# Altium schematic sheet Circuit.SchDoc
size A3; ApprovedBy: Dr.Ogr.Uys.Sertaç Savaş; CheckedBy: Dr.Ogr.Uys.Sertaç Savaş; Engineer: Nasıf Can Peltek; DocumentNumber: 2; Revision: -; SheetNumber: 2; SheetTotal: 2; releaseDate: 24.03.2024; changeDate: -; Department: Faculty Of  Engineering; Size: A3; projeDescription: N555 Driver Card; fileName: Circuit.SchDoc
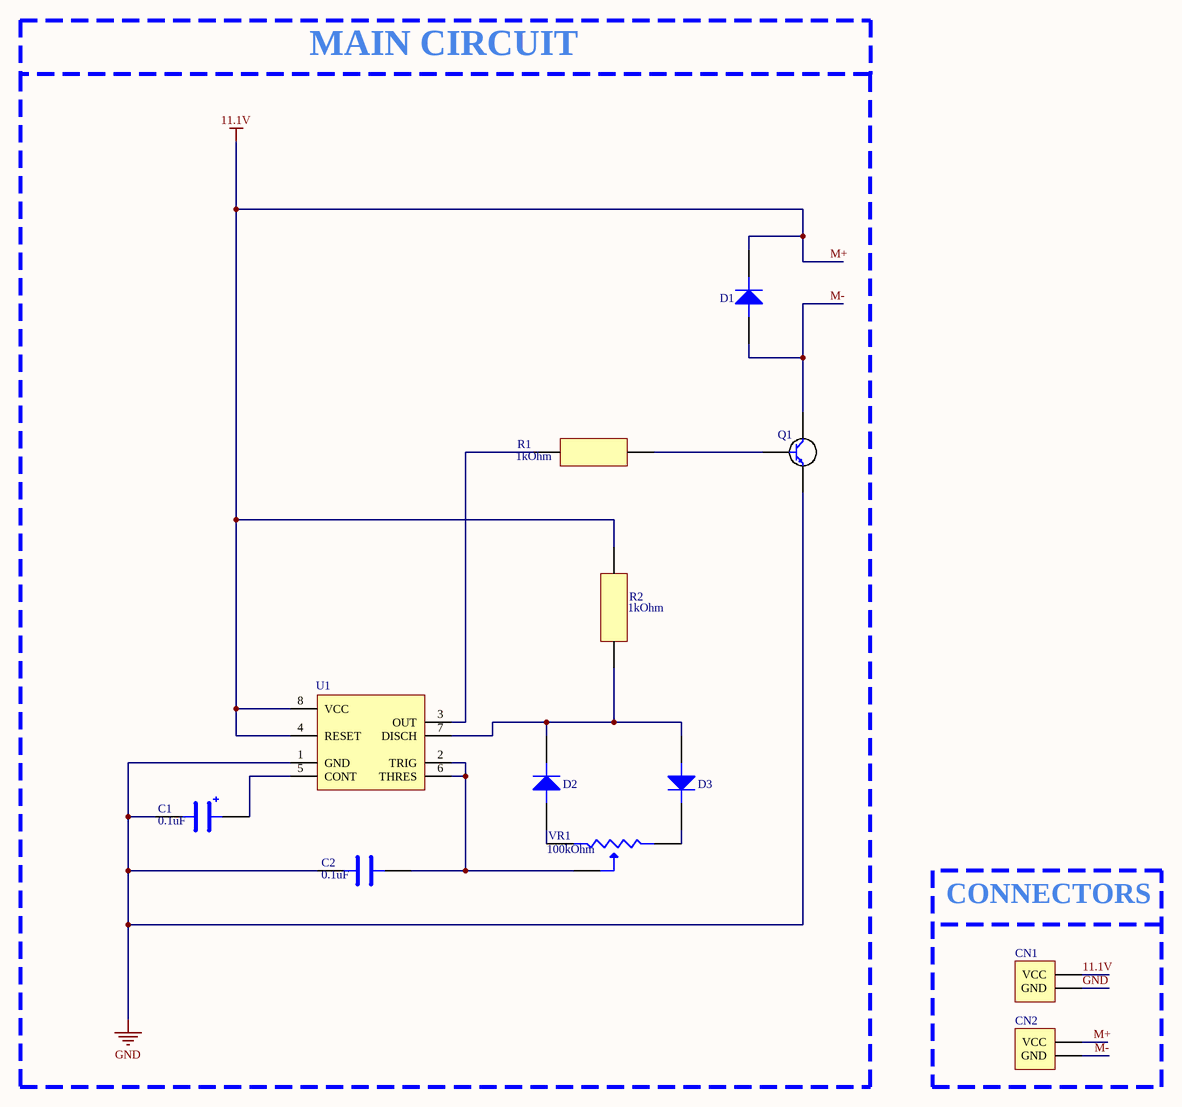
[diagram p0: Circuit.SchDoc]

## Parts
C1  Capacitor: 0.1uF  [CAP_ALUM]  (hidden comment: 860020772001)
C2  Capacitor: 0.1uF  [CAP_FILM]  (hidden comment: R82EC3100DQ70J)
CN1  732-10955-ND  [BULK]  (value not drawn)
CN2  732-10955-ND  [BULK]  (value not drawn)
D1  1N4007G-T  [DO41]  (value not drawn)
D2  1N4007G-T  [DO41]  (value not drawn)
D3  1N4007G-T  [DO41]  (value not drawn)
Q1  497-2543-5-ND  [TO220]  (value not drawn)
R1  Resistor: 1kOhm  [AXIAL]  (hidden comment: CF14JT1K00)
R2  Resistor: 1kOhm  [AXIAL]  (hidden comment: CF14JT1K00)
U1  NE555P  [DIP8]  (value not drawn)
VR1  Resistor: 100kOhm  [POT]  (hidden comment: P160KN2-0EC15B100K)

## Blocks framed on the sheet
MAIN CIRCUIT: C1 C2 D1-D3 Q1 R1 R2 U1 VR1
CONNECTORS: CN1 CN2

## Nets
11.1V: CN1.1(VCC) CN2.1(VCC) D1.2 R2.2 U1.4(RESET) U1.8(VCC)  [also labelled M+]
GND: C1.1(Cathode) C2.1 CN1.2(GND) Q1.3(Emitter) U1.1(GND)
M-: CN2.2(GND) D1.1 Q1.2(Collector)
NetC1_2: C1.2(Anode) U1.5(CONT)
NetC2_2: C2.2 U1.2(TRIG) U1.6(THRES) VR1.2
NetD2_1: D2.1 VR1.1
NetD2_2: D2.2 D3.1 R2.1 U1.7(DISCH)
NetD3_2: D3.2 VR1.3
NetQ1_1: Q1.1(Base) R1.2
NetR1_1: R1.1 U1.3(OUT)

## Notes on the sheet
- FILE NAME
- PREPARED BY
- DESCRIPTION
- RELEASE DATE
- DEPARTMENT
- CHECKED BY
- APPROVED BY
- SIZE
- REVISION
- CHANGE DATE
- SHEET
- /

## Library data of the parts
C1 = CAP ALUM 0.1uF: WCAP-ATG5 Aluminum Electrolytic Capacitors; Manufacturer: Wurth Electronics; Designed By: Nasıf Can Peltek; Leakage Current: 3uA; Pitch: 2mm; Max Operating Voltage: 63V; Supplier 1: Mouser; Manufacturer Part Number: 860020772001; RoHS: Yes; Category: Aluminum Electrolytic Capacitors; Stock 1: 776; Pricing 1: 1=0,11, 10=0,109, 50=0,093, 100=0,081, 1000=0,06, 10000=0,06 (USD); Length: 11mm; ComponentLink1URL: http://www.farnell.com/datasheets/1879675.pdf?src-supplier=Farnell; ComponentLink1Description: http://www.farnell.com/datasheets/1879675.pdf?src-supplier=Farnell; ComponentLink2URL: http://katalog.we-online.de/pbs/datasheet/860020772001.pdf?src-supplier=Digikey; ComponentLink2Description: http://katalog.we-online.de/pbs/datasheet/860020772001.pdf?src-supplier=Digikey; ComponentLink3URL: https://katalog.we-online.de/pbs/datasheet/860020772001.pdf?src-supplier=Digikey; ComponentLink3Description: https://katalog.we-online.de/pbs/datasheet/860020772001.pdf?src-supplier=Digikey; ComponentLink4URL: http://www.farnell.com/datasheets/1879675.pdf?src-supplier=Element14; ComponentLink4Description: http://www.farnell.com/datasheets/1879675.pdf?src-supplier=Element14; Supplier Part Number 1: 710-860020772001; Case/Package: RADIAL
C2 = CAP FILM 0.1uF: Cap Film 0.1uF 100V PET 5% (7.2 X 2.5 X 6.5mm) Radial 5mm 105C Ammo Pack; Manufacturer: KEMET; Designed By: Nasıf Can Peltek; Max Operating Voltage: 63V; Supplier 1: Digikey; Manufacturer Part Number: R82EC3100DQ70J; RoHS: Yes; Category: Film Capacitors; Stock 1: 75554; Pricing 1: 1=0,3, 10=0,195, 50=0,1436, 100=0,1169, 500=0,09226, 1000=0,07791 (USD); Number of Pins: 2NUMBER; ComponentLink1URL: https://datasheet.ciiva.com/11790/0900766b8002a2e5-11790687.pdf?src-supplier=Rs; ComponentLink1Description: https://datasheet.ciiva.com/11790/0900766b8002a2e5-11790687.pdf?src-supplier=Rs; ComponentLink2URL: https://datasheet.ciiva.com/8031/1425445-8031381.pdf?src-supplier=Element14; ComponentLink2Description: https://datasheet.ciiva.com/8031/1425445-8031381.pdf?src-supplier=Element14; Supplier Part Number 1: 399-5453-1-ND; Case/Package: RADIAL
CN1 CN2 = TERMINAL BLOCK: Series 1377 - 5.00 mm Horizontal Entry with Pressure Clamp WR-TBL, 2 pin; Manufacturer: Wurth Electronics; Manufacturer Part Number: 691137710002; Designed By: Nasıf Can Peltek; Plating: Copper Alloy,ZINC PLATED; Number of Levels: 1; Number of Positions Per Level: 2; Current: 16A; Voltage: 300V; Number of Contacts: 2NUMBER; Wire Gauge (Max): 30AWG; Wire Gauge (Min): 12AWG; Supplier 1: Digikey; RoHS: Yes; Category: Terminal Blocks; Stock 1: 3711; Pricing 1: 1=0,41, 10=0,363, 50=0,32, 100=0,287, 500=0,277 (USD); Mount: Through Hole; Number of Pins: 2NUMBER; Color: Green; Housing Material: PC; Contact Material: 153,154ConductorMaterial; Min Operating Temperature: -30°C; Max Operating Temperature: 120°C; Termination: Screw; Series: WR-TBL Series 1377; Current Rating: 16A; Number of Rows: 1NUMBER; Voltage Rating: 300V; Height: 11.6mm; Lead Pitch: 5mm; RoHS Compliant: Yes; ComponentLink1URL: https://katalog.we-online.de/em/datasheet/691137710002.pdf?src-supplier=Digikey; ComponentLink1Description: https://katalog.we-online.de/em/datasheet/691137710002.pdf?src-supplier=Digikey; Supplier Part Number 1: 732-10955-ND; Case/Package: BULK
D1-D3 = DIODE 1N4007: Diode Standard 1000V (1kV) 1A Through Hole DO-41; Manufacturer: Diodes; Designed By: Nasıf Can Peltek; Supplier 1: Digikey; Manufacturer Part Number: 1N4007G-T; RoHS: Yes; Category: Rectifier Diodes; Stock 1: 387119; Pricing 1: 1=0,28, 10=0,191, 100=0,0933, 500=0,07784, 1000=0,05409, 2000=0,04688 (USD); ComponentLink1URL: https://datasheet.ciiva.com/36525/1537942-36525995.pdf?src-supplier=Jameco; ComponentLink1Description: https://datasheet.ciiva.com/36525/1537942-36525995.pdf?src-supplier=Jameco; ComponentLink2URL: https://datasheet.ciiva.com/15219/getdatasheetpartid-213960-15219547.pdf?src-supplier=Verical; ComponentLink2Description: https://datasheet.ciiva.com/15219/getdatasheetpartid-213960-15219547.pdf?src-supplier=Verical; ComponentLink3URL: https://datasheet.ciiva.com/912/ds29002-912230.pdf?src-supplier=Digikey; ComponentLink3Description: https://datasheet.ciiva.com/912/ds29002-912230.pdf?src-supplier=Digikey; ComponentLink4URL: https://datasheet.ciiva.com/16395/ds29002-16395514.pdf?src-supplier=Future+Electronics; ComponentLink4Description: https://datasheet.ciiva.com/16395/ds29002-16395514.pdf?src-supplier=Future+Electronics; Supplier Part Number 1: 1N4007GDICT-ND; Max Supply Voltage: 1000V; Operating Supply Current: 1A; Case/Package: DO41
Q1 = BJT DARLINGTON: TIP122 Series NPN/PNP 100 V 5 A Complimentary Darlington Transistor - TO-220-3; Manufacturer: STMicroelectronics; Designed By: Nasıf Can Peltek; Max Current: 5A; Power: 2W; Max Collector Current: 500uA; Max Supply Voltage: 100V; Supplier 1: Digikey; Manufacturer Part Number: TIP122; RoHS: Yes; Category: BJTs; Stock 1: 55; Pricing 1: 1=0,78, 50=0,6482, 100=0,4704, 500=0,39306, 1000=0,33451, 2000=0,29793, 5000=0,28224, 10000=0,26134 (USD); ComponentLink1URL: https://datasheet.ciiva.com/15139/getdatasheetpartid-89197-15139978.pdf?src-supplier=Verical; ComponentLink1Description: https://datasheet.ciiva.com/15139/getdatasheetpartid-89197-15139978.pdf?src-supplier=Verical; ComponentLink2URL: https://datasheet.ciiva.com/29323/155442-da-01-en-transistor-tip122-stm-29323616.pdf?src-supplier=Conrad; ComponentLink2Description: https://datasheet.ciiva.com/29323/155442-da-01-en-transistor-tip122-stm-29323616.pdf?src-supplier=Conrad; ComponentLink3URL: https://datasheet.ciiva.com/977/cd00000911-977180.pdf?src-supplier=Digikey; ComponentLink3Description: https://datasheet.ciiva.com/977/cd00000911-977180.pdf?src-supplier=Digikey; ComponentLink4URL: https://datasheet.ciiva.com/14546/70013738-14546039.pdf?src-supplier=Allied+Electronics; ComponentLink4Description: https://datasheet.ciiva.com/14546/70013738-14546039.pdf?src-supplier=Allied+Electronics; Supplier Part Number 1: 497-2543-5-ND; Operating Temperature: 150C; Case/Package: TO220
R1 R2 = RES 1K OHM: Res Carbon Film 1K Ohm 5% 1/4W -400ppm/°C to 0ppm/°C Conformal AXL Thru-Hole T/R; Manufacturer: Stackpole Electronics; Designed By: Nasıf Can Peltek; Supplier 1: Digikey; Manufacturer Part Number: CF14JT1K00; RoHS: Yes; Category: Through-Hole Resistors; Stock 1: 837724; Pricing 1: 1=0,1, 10=0,053, 25=0,0404, 50=0,0308, 100=0,0215, 250=0,01728, 500=0,01382, 1000=0,01017 (USD); ComponentLink1URL: http://components.arrow.com/part/dataview/27620077S9848643N1174?src-supplier=Arrow+Electronics; ComponentLink1Description: http://components.arrow.com/part/dataview/27620077S9848643N1174?src-supplier=Arrow+Electronics; ComponentLink2URL: https://www.seielect.com/catalog/SEI-CF_CFM.pdf?src-supplier=Avnet; ComponentLink2Description: https://www.seielect.com/catalog/SEI-CF_CFM.pdf?src-supplier=Avnet; ComponentLink3URL: https://www.seielect.com/catalog/SEI-Packaging.pdf?src-supplier=Digikey; ComponentLink3Description: https://www.seielect.com/catalog/SEI-Packaging.pdf?src-supplier=Digikey; ComponentLink4URL: https://www.seielect.com/Catalog/SEI-CF_CFM.pdf?src-supplier=Digikey; ComponentLink4Description: https://www.seielect.com/Catalog/SEI-CF_CFM.pdf?src-supplier=Digikey; ComponentLink5URL: http://www.seielect.com/Catalog/SEI-CF_CFM.pdf?src-supplier=Future+Electronics; ComponentLink5Description: http://www.seielect.com/Catalog/SEI-CF_CFM.pdf?src-supplier=Future+Electronics; ComponentLink6URL: https://www.verical.com/server-webapp/html/getDatasheet?partID=360403&src-supplier=Verical; ComponentLink6Description: https://www.verical.com/server-webapp/html/getDatasheet?partID=360403&src-supplier=Verical; ComponentLink7URL: https://datasheet.octopart.com/CF14JT1K00-Stackpole-Electronics-datasheet-8360004.pdf?src-supplier=Future+Electronics; ComponentLink7Description: https://datasheet.octopart.com/CF14JT1K00-Stackpole-Electronics-datasheet-8360004.pdf?src-supplier=Future+Electronics; ComponentLink8URL: https://datasheet.octopart.com/CF14JT1K00-Stackpole-Electronics-datasheet-32780772.pdf?src-supplier=Master+Electronics; ComponentLink8Description: https://datasheet.octopart.com/CF14JT1K00-Stackpole-Electronics-datasheet-32780772.pdf?src-supplier=Master+Electronics; Supplier Part Number 1: CF14JT1K00CT-ND; Power: 1/4W; Case/Package: AXIAL
U1 = NE555: 555 Type, Timer/Oscillator (Single) Through Hole 8-PDIP; Manufacturer: Texas Instruments; Min Supply Voltage: 4.5V; Max Supply Voltage: 16V; Number of Timers/Counters: 1; Operating Supply Current: 2mA; High Level Output Current: 200mA; Low Level Output Current: -200mA; Designed By: Nasıf Can Peltek; Supplier 1: Digikey; Manufacturer Part Number: NE555P; RoHS: Yes; Category: Timers and Oscillators; Stock 1: 49198; Pricing 1: 1=0,46, 10=0,394, 50=0,3676, 100=0,2941, 250=0,27312, 500=0,23108, 1000=0,17857, 2500=0,16281, 5000=0,15231 (USD); Case/Package: DIP8; Weight: 0.015535oz; Min Operating Temperature: 0°C; Max Operating Temperature: 70°C; Packaging: Rail/Tube; Package Quantity: 50; Series: NE555; Length: 9.81mm; Width: 6.35mm; Height: 4.57mm; Thickness: 3.9mm; Lead Free: Lead Free; RoHS Compliant: Yes; ComponentLink1URL: https://datasheet.ciiva.com/19457/904085-19457361.pdf?src-supplier=Jameco; ComponentLink1Description: https://datasheet.ciiva.com/19457/904085-19457361.pdf?src-supplier=Jameco; ComponentLink2URL: https://datasheet.ciiva.com/1139/sa555-1139904.pdf?src-supplier=Element14; ComponentLink2Description: https://datasheet.ciiva.com/1139/sa555-1139904.pdf?src-supplier=Element14; ComponentLink3URL: https://datasheet.ciiva.com/26325/152184-da-01-en-ne555p-timer-tid-26325915.pdf?src-supplier=Conrad; ComponentLink3Description: https://datasheet.ciiva.com/26325/152184-da-01-en-ne555p-timer-tid-26325915.pdf?src-supplier=Conrad; ComponentLink4URL: https://datasheet.ciiva.com/14094/ne555-series-eng-tds-14094950.pdf?src-supplier=Distrelec; ComponentLink4Description: https://datasheet.ciiva.com/14094/ne555-series-eng-tds-14094950.pdf?src-supplier=Distrelec; ComponentLink5URL: https://datasheet.ciiva.com/1233/ne555-1233454.pdf?src-supplier=Digikey; ComponentLink5Description: https://datasheet.ciiva.com/1233/ne555-1233454.pdf?src-supplier=Digikey; ComponentLink6URL: https://datasheet.ciiva.com/1147/1764032-1147750.pdf?src-supplier=Newark; ComponentLink6Description: https://datasheet.ciiva.com/1147/1764032-1147750.pdf?src-supplier=Newark; ComponentLink7URL: https://datasheet.ciiva.com/14274/ne555-14274456.pdf?src-supplier=Avnet; ComponentLink7Description: https://datasheet.ciiva.com/14274/ne555-14274456.pdf?src-supplier=Avnet; ComponentLink8URL: https://datasheet.ciiva.com/15152/getdatasheetpartid-248510-15152620.pdf?src-supplier=Verical; ComponentLink8Description: https://datasheet.ciiva.com/15152/getdatasheetpartid-248510-15152620.pdf?src-supplier=Verical; Supplier Part Number 1: 296-NE555P-ND
VR1 = POT 100K OHM: P160 Series 0.2 W 100 kO Side Adjust Long PC Pins Conductive Plastic Potentiometer; Manufacturer: TT BI; Designed By: Nasıf Can Peltek; Supplier 1: Digikey; Manufacturer Part Number: P160KN2-0EC15B100K; RoHS: Yes; Category: Variable Resistors and Potentiometers; Stock 1: 609; Pricing 1: 1=1,34, 10=1,182, 25=1,0636, 40=1,02425, 80=0,98475, 230=0,92565, 440=0,7878, 990=0,72872, 4950=0,59873 (USD); ComponentLink1URL: https://datasheet.ciiva.com/4993/p160-20748-4993339.pdf?src-supplier=Mouser; ComponentLink1Description: https://datasheet.ciiva.com/4993/p160-20748-4993339.pdf?src-supplier=Mouser; Supplier Part Number 1: 987-1572-ND; Case/Package: POT100K